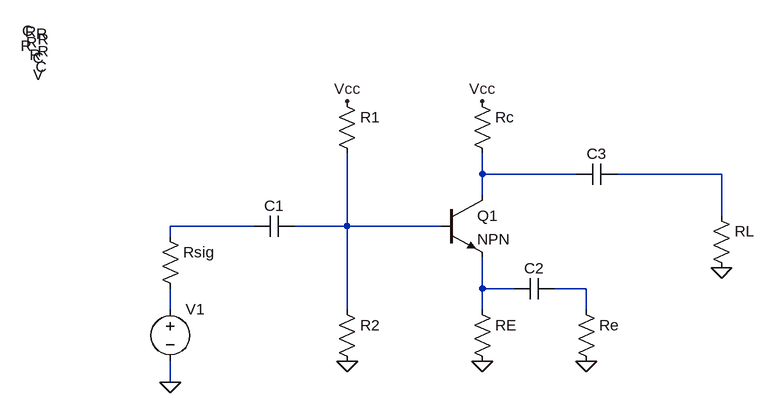
[diagram p0: schematic Draft1.asc]
Draft1.asc, the LTspice schematic file:
Version 4
SHEET 1 880 680
WIRE 368 128 368 96
WIRE 512 128 368 128
WIRE 736 128 576 128
WIRE 368 160 368 128
WIRE 736 192 736 128
WIRE 16 208 -112 208
WIRE 160 208 160 96
WIRE 160 208 80 208
WIRE 304 208 160 208
WIRE -112 224 -112 208
WIRE 368 304 368 256
WIRE 416 304 368 304
WIRE 528 304 480 304
WIRE -112 336 -112 304
WIRE 160 336 160 208
WIRE 368 336 368 304
WIRE 528 336 528 304
WIRE -112 448 -112 416
FLAG 528 416 0
FLAG 368 416 0
FLAG 160 416 0
FLAG 736 272 0
FLAG -112 448 0
FLAG 368 16 Vcc
FLAG 160 16 Vcc
SYMBOL res 144 0 R0
WINDOW 3 -460 -80 Left 0
SYMATTR InstName R1
SYMBOL res 352 0 R0
WINDOW 3 -670 -88 Left 0
SYMATTR InstName Rc
SYMBOL res 352 320 R0
WINDOW 3 -687 -411 Left 0
SYMATTR InstName RE
SYMBOL res 512 320 R0
WINDOW 3 -854 -390 Left 0
SYMATTR InstName Re
SYMBOL res 720 176 R0
WINDOW 3 -1054 -251 Left 0
SYMATTR InstName RL
SYMBOL res 144 320 R0
WINDOW 3 -472 -376 Left 0
SYMATTR InstName R2
SYMBOL res -128 208 R0
WINDOW 3 -188 -269 Left 0
SYMATTR InstName Rsig
SYMBOL voltage -112 320 R0
WINDOW 3 -211 -345 Left 0
SYMATTR InstName V1
SYMBOL npn 304 160 R0
SYMATTR InstName Q1
SYMBOL cap 80 192 R90
WINDOW 0 0 32 VBottom 0
WINDOW 3 -245 390 VTop 0
SYMATTR InstName C1
SYMBOL cap 480 288 R90
WINDOW 0 0 32 VBottom 0
WINDOW 3 -355 795 VTop 0
SYMATTR InstName C2
SYMBOL cap 576 112 R90
WINDOW 0 0 32 VBottom 0
WINDOW 3 -220 907 VTop 0
SYMATTR InstName C3

The netlist it stands for:
* Draft1.asc
R1 Vcc N004 R
Rc Vcc N001 R
RE N005 0 R
Re N006 0 R
RL N002 0 R
R2 N004 0 R
Rsig N003 N007 R
V1 N007 0 V
Q1 N001 N004 N005 0 NPN
C1 N004 N003 C
C2 N006 N005 C
C3 N002 N001 C
.model NPN NPN
.model PNP PNP
.lib standard.bjt
.backanno
.end